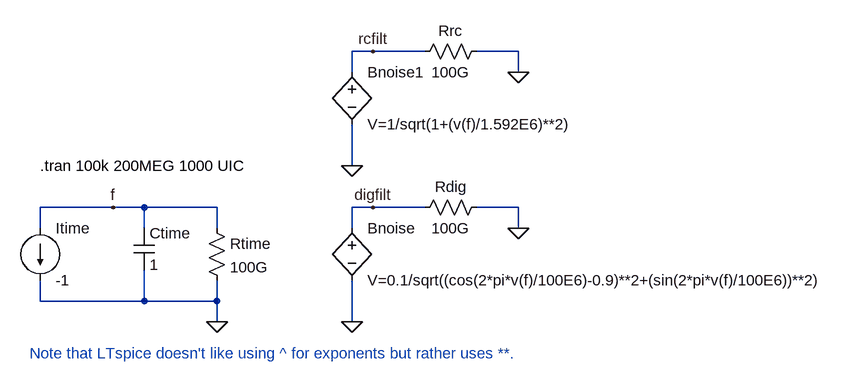
[diagram p0: schematic _Fig3_28_MSD.asc]
_Fig3_28_MSD.asc, the LTspice schematic file:
Version 4
SHEET 1 2740 696
WIRE 608 -448 608 -480
WIRE 608 -336 608 -368
WIRE 720 -480 608 -480
WIRE 768 -480 720 -480
WIRE 768 -448 768 -480
WIRE 768 -336 608 -336
WIRE 768 -336 768 -384
WIRE 880 -480 768 -480
WIRE 880 -448 880 -480
WIRE 880 -336 768 -336
WIRE 880 -336 880 -368
WIRE 880 -304 880 -336
WIRE 1088 -688 1088 -720
WIRE 1088 -544 1088 -608
WIRE 1088 -448 1088 -480
WIRE 1088 -304 1088 -368
WIRE 1120 -720 1088 -720
WIRE 1120 -480 1088 -480
WIRE 1200 -720 1120 -720
WIRE 1200 -480 1120 -480
WIRE 1344 -720 1280 -720
WIRE 1344 -688 1344 -720
WIRE 1344 -480 1280 -480
WIRE 1344 -448 1344 -480
FLAG 720 -480 f
FLAG 880 -304 0
FLAG 1088 -304 0
FLAG 1344 -448 0
FLAG 1120 -480 digfilt
FLAG 1088 -544 0
FLAG 1344 -688 0
FLAG 1120 -720 rcfilt
SYMBOL current 608 -448 R0
WINDOW 123 0 0 Left 0
WINDOW 39 0 0 Left 0
SYMATTR InstName Itime
SYMATTR Value -1
SYMBOL cap 752 -448 R0
SYMATTR InstName Ctime
SYMATTR Value 1
SYMBOL res 864 -464 R0
SYMATTR InstName Rtime
SYMATTR Value 100G
SYMBOL bv 1088 -464 R0
SYMATTR InstName Bnoise
SYMATTR Value V=0.1/sqrt((cos(2*pi*v(f)/100E6)-0.9)**2+(sin(2*pi*v(f)/100E6))**2)
SYMBOL res 1296 -496 R90
WINDOW 0 0 56 VBottom 0
WINDOW 3 32 56 VTop 0
SYMATTR InstName Rdig
SYMATTR Value 100G
SYMBOL bv 1088 -704 R0
SYMATTR InstName Bnoise1
SYMATTR Value V=1/sqrt(1+(v(f)/1.592E6)**2)
SYMBOL res 1296 -736 R90
WINDOW 0 0 56 VBottom 0
WINDOW 3 32 56 VTop 0
SYMATTR InstName Rrc
SYMATTR Value 100G
TEXT 608 -544 Left 0 !.tran 100k 200MEG 1000 UIC
TEXT 592 -256 Left 0 ;Note that LTspice doesn't like using ^ for exponents but rather uses **.

The netlist it stands for:
* _Fig3_28_MSD.asc
Itime f 0 -1
Ctime f 0 1
Rtime f 0 100G
Bnoise digfilt 0 V=0.1/sqrt((cos(2*pi*v(f)/100E6)-0.9)**2+(sin(2*pi*v(f)/100E6))**2)
Rdig 0 digfilt 100G
Bnoise1 rcfilt 0 V=1/sqrt(1+(v(f)/1.592E6)**2)
Rrc 0 rcfilt 100G
.tran 100k 200MEG 1000 UIC
* Note that LTspice doesn't like using ^ for exponents but rather uses **.
.backanno
.end